# Altium schematic sheet MK66F.SchDoc
size Legal
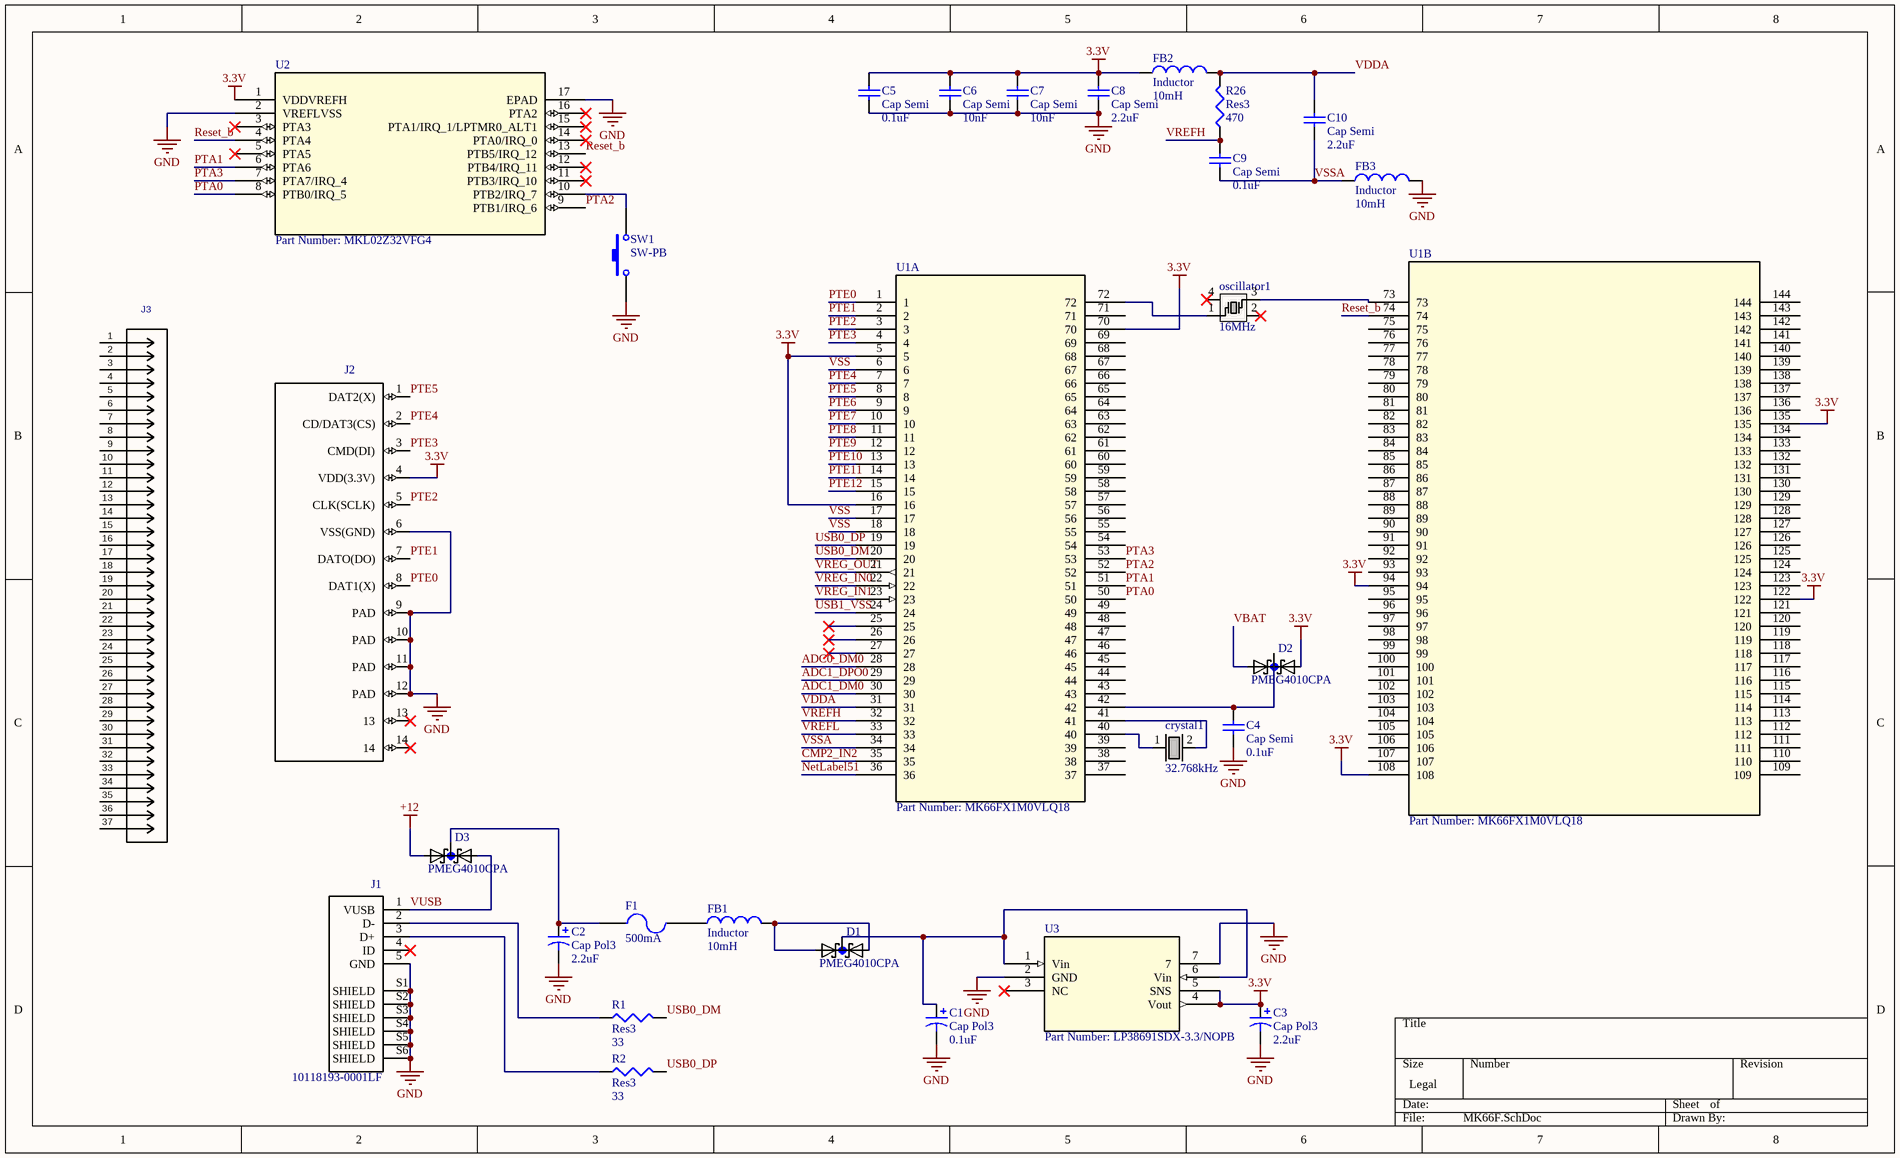
[diagram p0: MK66F.SchDoc]

## Parts
C1  Cap Pol3  value 0.1uF  [C1206]
C2  Cap Pol3  value 2.2uF  [C1206]
C3  Cap Pol3  value 2.2uF  [C1206]
C4  Cap Semi  value 0.1uF  [C1206]
C5  Cap Semi  value 0.1uF  [C1206]
C6  Cap Semi  value 10nF  [C1206]
C7  Cap Semi  value 10nF  [C1206]
C8  Cap Semi  value 2.2uF  [C1206]
C9  Cap Semi  value 0.1uF  [C1206]
C10  Cap Semi  value 2.2uF  [C1206]
crystal1  value 32.768kHz  [ECS-.327-CDX-1128]  (hidden comment: SMD_Crystal)
D1  PMEG4010CPA  [*SOT1061]
D2  PMEG4010CPA  [*SOT1061]
D3  PMEG4010CPA  [*SOT1061]
F1  500mA  [RESC3216X125N]
FB1  Inductor  value 10mH  [J1-0603]
FB2  Inductor  value 10mH  [J1-0603]
FB3  Inductor  value 10mH  [J1-0603]
J1  10118193-0001LF  [FCI_10118193-0001LF_10118193-0001LF(Primary)]
J2  1140084168  [*1140084168]  (value not drawn)
J3  5747847-4  [SPGA48x11 - duplicate]  (value not drawn)
oscillator1  value 16MHz  [ECS-160-8-30B-CKM]  (hidden comment: SMD_oscillator)
R1  Res3  value 33  [J1-0603]
R2  Res3  value 33  [J1-0603]
R26  Res3  value 470  [J1-0603]
SW1  SW-PB  [P13348SCT-ND]
U1  Part Number: MK66FX1M0VLQ18  [98ASS23177W]  (parts A,B of 2)
U2  Part Number: MKL02Z32VFG4  [QFN-16_3X3X0.65]
U3  Part Number: LP38691SDX-3.3/NOPB  [SDE06A]

## Nets
3.3V: C3.1 C5.2 C6.2 C7.2 C8.2 D2.2(A2) FB2.1 J2.4(VDD(3.3V)) U1.5 U1.16 U1.70 U1.94 U1.108 U1.122 U1.135 U2.1(VDDVREFH) U3.4(Vout) U3.5(SNS)
+12: D3.1(A1)
GND: C1.2 C2.2 C3.2 C4.1 C5.1 C6.1 C7.1 C8.1 FB3.2 J1.5(GND) J1.S1(SHIELD) J1.S2(SHIELD) J1.S3(SHIELD) J1.S4(SHIELD) J1.S5(SHIELD) J1.S6(SHIELD) J2.6(VSS(GND)) J2.9(PAD) J2.10(PAD) J2.11(PAD) J2.12(PAD) SW1.1 U2.2(VREFLVSS) U2.17(EPAD) U3.2(GND) U3.7
ADC0_DM0: U1.28
ADC1_DM0: U1.30
ADC1_DPO0: U1.29
CMP2_IN2: U1.35
NetLabel51: U1.36
PTA0: U1.50 U2.8(PTB0/IRQ_5)
PTA1: U1.51 U2.6(PTA6)
PTA2: U1.52 U2.9(PTB1/IRQ_6)
PTA3: U1.53 U2.7(PTA7/IRQ_4)
PTE0: J2.8(DAT1(X)) U1.1
PTE1: J2.7(DATO(DO)) U1.2
PTE2: J2.5(CLK(SCLK)) U1.3
PTE3: J2.3(CMD(DI)) U1.4
PTE4: J2.2(CD/DAT3(CS)) U1.7
PTE5: J2.1(DAT2(X)) U1.8
PTE6: U1.9
PTE7: U1.10
PTE8: U1.11
PTE9: U1.12
PTE10: U1.13
PTE11: U1.14
PTE12: U1.15
Reset_b: U1.74 U2.4(PTA4) U2.13(PTB5/IRQ_12)
USB0_DM: R1.2 U1.20
USB0_DP: R2.2 U1.19
USB1_VSS: U1.24
VBAT: D2.1(A1)
VDDA: C10.2 FB2.2 R26.2 U1.31
VREFH: C9.2 R26.1 U1.32
VREFL: U1.33
VREG_IN0: U1.22
VREG_IN1: U1.23
VREG_OUT: U1.21
VSS: U1.6 U1.17 U1.18
VSSA: C9.1 C10.1 FB3.1 U1.34
VUSB: D3.2(A2) J1.1(VUSB)
NetC1_1: C1.1 D1.3(K1K2) U3.1(Vin) U3.6(Vin)
NetC2_1: C2.1 D3.3(K1K2) F1.1
NetC4_2: C4.2 U1.42
Netcrystal1_1: crystal1.1 U1.40
Netcrystal1_2: crystal1.2 U1.41
NetD1_1: D1.1(A1) D1.2(A2) FB1.2
NetF1_2: F1.2 FB1.1
NetJ1_2: J1.2(D-) R1.1
NetJ1_3: J1.3(D+) R2.1
Netoscillator1_1: oscillator1.1 U1.72
Netoscillator1_3: oscillator1.3 U1.73
NetSW1_2: SW1.2 U2.10(PTB2/IRQ_7)

Not connected (* = marked no-connect by the designer): D2 3(K1K2); J1 4(ID)*; J2 13* 14*; J3 1 2 3 4 5 6 7 8 9 10 11 12 13 14 15 16 17 18 19 20 21 22 23 24 25 26 27 28 29 30 31 32 33 34 35 36 37; oscillator1 2* 4*; U1 25* 26* 27* 37 38 39 43 44 45 46 47 48 49 54 55 56 57 58 59 60 61 62 63 64 65 66 67 68 69 71 75 76 77 78 79 80 81 82 83 84 85 86 87 88 89 90 91 92 93 95 96 97 98 99 100 101 102 103 104 105 106 107 109 110 111 112 113 114 115 116 117 118 119 120 121 123 124 125 126 127 128 129 130 131 132 133 134 136 137 138 139 140 141 142 143 144; U2 3(PTA3)* 5(PTA5)* 11(PTB3/IRQ_10)* 12(PTB4/IRQ_11)* 14(PTA0/IRQ_0)* 15(PTA1/IRQ_1/LPTMR0_ALT1)* 16(PTA2)*; U3 3(NC)*

## Library data of the parts
C1 = Cap Pol3: Polarized Capacitor (Surface Mount); SPN: 1276-1017-1-ND; Published: 8-Jun-2000; LatestRevisionDate: 29-May-2009; LatestRevisionNote: IPC-7351 Footprint Added.; PackageReference: C0805; Publisher: Altium Limited; PackageDescription: Chip Capacitor
C2 C3 = Cap Pol3: Polarized Capacitor (Surface Mount); SPN: 311-3513-1-ND; Published: 8-Jun-2000; LatestRevisionDate: 29-May-2009; LatestRevisionNote: IPC-7351 Footprint Added.; PackageReference: C0805; Publisher: Altium Limited; PackageDescription: Chip Capacitor
C4 C5 C9 = Cap Semi: Capacitor (Semiconductor SIM Model); SPN: 1276-1017-1-ND; Published: 8-Jun-2000; LatestRevisionDate: 29-May-2009; LatestRevisionNote: IPC-7351 Footprint Added.; PackageReference: C1206; Publisher: Altium Limited; PackageDescription: Chip Capacitor
C6 C7 = Cap Semi: Capacitor (Semiconductor SIM Model); SPN: 1276-2735-1-ND; Published: 8-Jun-2000; LatestRevisionDate: 29-May-2009; LatestRevisionNote: IPC-7351 Footprint Added.; PackageReference: C1206; Publisher: Altium Limited; PackageDescription: Chip Capacitor
C8 C10 = Cap Semi: Capacitor (Semiconductor SIM Model); SPN: 311-3513-1-ND; Published: 8-Jun-2000; LatestRevisionDate: 29-May-2009; LatestRevisionNote: IPC-7351 Footprint Added.; PackageReference: C1206; Publisher: Altium Limited; PackageDescription: Chip Capacitor
crystal1 = ECS-.327-CDX-1128: SPN: XC2190CT-ND
D1-D3 = PMEG4010CPA: DIODE, DUAL, SCH, 40V, 1A, SOT1061; Diode Type: Schottky; Diode Configuration: Dual, Common Cathode; Repetitive Rever...; MF: Nexperia USA; SnapEDA_Link: https://www.snapeda.com/parts/PMEG4010CPA/Nexperia%20USA%20Inc./view-part/?ref=snap; MP: PMEG4010CPA; Package: PowerUDFN-3 Nexperia USA; Digi-Key_Purchase_URL: https://www.digikey.ca/product-detail/en/nexperia-usa-inc/PMEG4010CPASX/1727-2405-1-ND/5436151?utm_source=snapeda&utm_medium=aggregator&utm_campaign=symbol; Digi-Key_Part_Number: 1727-5212-1-ND; Value: *
F1 = Fuse 2: Fuse; SPN: 507-1797-1-ND; Published: 8-Jun-2000; LatestRevisionDate: 17-Jul-2002; LatestRevisionNote: Re-released for DXP Platform.; PackageReference: PIN-W2/E2.8; Publisher: Altium Limited; PackageDescription: Thru-Hole; 2 Leads
FB1-FB3 = Inductor: Code_IEC: 1005; SPN: 490-1037-1-ND; Published: 8-Jun-2000; LatestRevisionDate: 29-May-2009; LatestRevisionNote: IPC-7351 Footprint Added.; PackageReference: 0402-A; Publisher: Altium Limited; PackageDescription: Chip Inductor; Code_JEITA: 0402
J1 = 10118193-0001LF: Single Port 5 Contact Shielded SMT MICRO USB B-Type Receptacle; MF: Amphenol FCI; SnapEDA_Link: https://www.snapeda.com/parts/10118193-0001LF/Amphenol%20FCI/view-part/?ref=snap; Digi-Key_Purchase_URL: https://www.digikey.ca/product-detail/en/amphenol-fci/10118193-0001LF/609-4616-1-ND/2785380?utm_source=snapeda&utm_medium=aggregator&utm_campaign=symbol; Package: None; MP: 10118193-0001LF; Digi-Key_Part_Number: 609-4616-1-ND; Value: *
J2 = 1140084168: Conn; IC Socket; Micro SD; Right Angle; PCB Mount; MicroSD Ser.; MF: Amphenol ICC; Package: None; MP: 1140084168; SnapEDA_Link: https://www.snapeda.com/parts/1140084168/Amphenol%20ICC/view-part/?ref=snap; Digi-Key_Purchase_URL: https://www.digikey.ca/product-detail/en/amphenol-icc-commercial-products/114-00841-68/114-00841-68-1-ND/2187101?utm_source=snapeda&utm_medium=aggregator&utm_campaign=symbol; Digi-Key_Part_Number: 114-00841-68-1-ND; Value: *
J3 = 5747847-4: C: Copyright (C) 2015 Accelerated Designs. All rights reserved; Vendor: TE Connectivity; Built_By: EMA_UL_Team; Value: 5747847-4; Manufacturer_Part_Number: 5747847-4
oscillator1 = ECS-160-8-30B-CKM: SPN: XC1839CT-ND
R1 R2 = Res3: Resistor; SPN: 541-2782-1-ND; Published: 8-Jun-2000; LatestRevisionDate: 29-May-2009; LatestRevisionNote: IPC-7351 Footprint Added.; PackageReference: J1-0603; Publisher: Altium Limited; PackageDescription: Chip Resistor
R26 = Res3: Resistor; SPN: RHM470ADCT-ND; Published: 8-Jun-2000; LatestRevisionDate: 29-May-2009; LatestRevisionNote: IPC-7351 Footprint Added.; PackageReference: J1-0603; Publisher: Altium Limited; PackageDescription: Chip Resistor
SW1 = SW-PB: Switch; Published: 24-Mar-1999; LatestRevisionDate: 17-Jul-2002; LatestRevisionNote: Re-released for DXP Platform.; PackageReference: SPST-2; Publisher: Altium Limited; PackageDescription: Switch; 2 Leads
U1 = MK66FX1M0VLQ18: No Description Available; Vendor: NXP; SPN: 568-13334-ND; Manufacturer_Part_Number: MK66FX1M0VLQ18; Copyright: Copyright (C) 2016 Accelerated Designs. All rights reserved; RefDes: RefDes; Type: DEV; Value: Value
U2 = MKL02Z32VFG4: No Description Available; Vendor: NXP; CPU: ARM Cortex-M0+; Max_Frequency: 48; Flash_KB: 32; SRAM_KB: 4; Pin_Count: 16; Manufacturer_Part_Number: MKL02Z32VFG4; Package: QFN; Copyright: Copyright (C) 2016 Accelerated Designs. All rights reserved; RefDes: RefDes; Type: DEV; Value: Value; ComponentLink1Description: Order from here; ComponentLink1URL: https://www.pjrc.com/store/ic_mkl02.html
U3 = LP38691SDX-3.3/N: No Description Available; Vendor: Texas Instruments; Built_By: EMA_UL_Team; Manufacturer_Part_Number: LP38691SDX-3.3/NOPB; Copyright: Copyright (C) 2018 Accelerated Designs. All rights reserved; RefDes: RefDes; Type: DEV; Value: Value